# EAGLE design breakout_pmg001 (EAGLE 9.6.2)
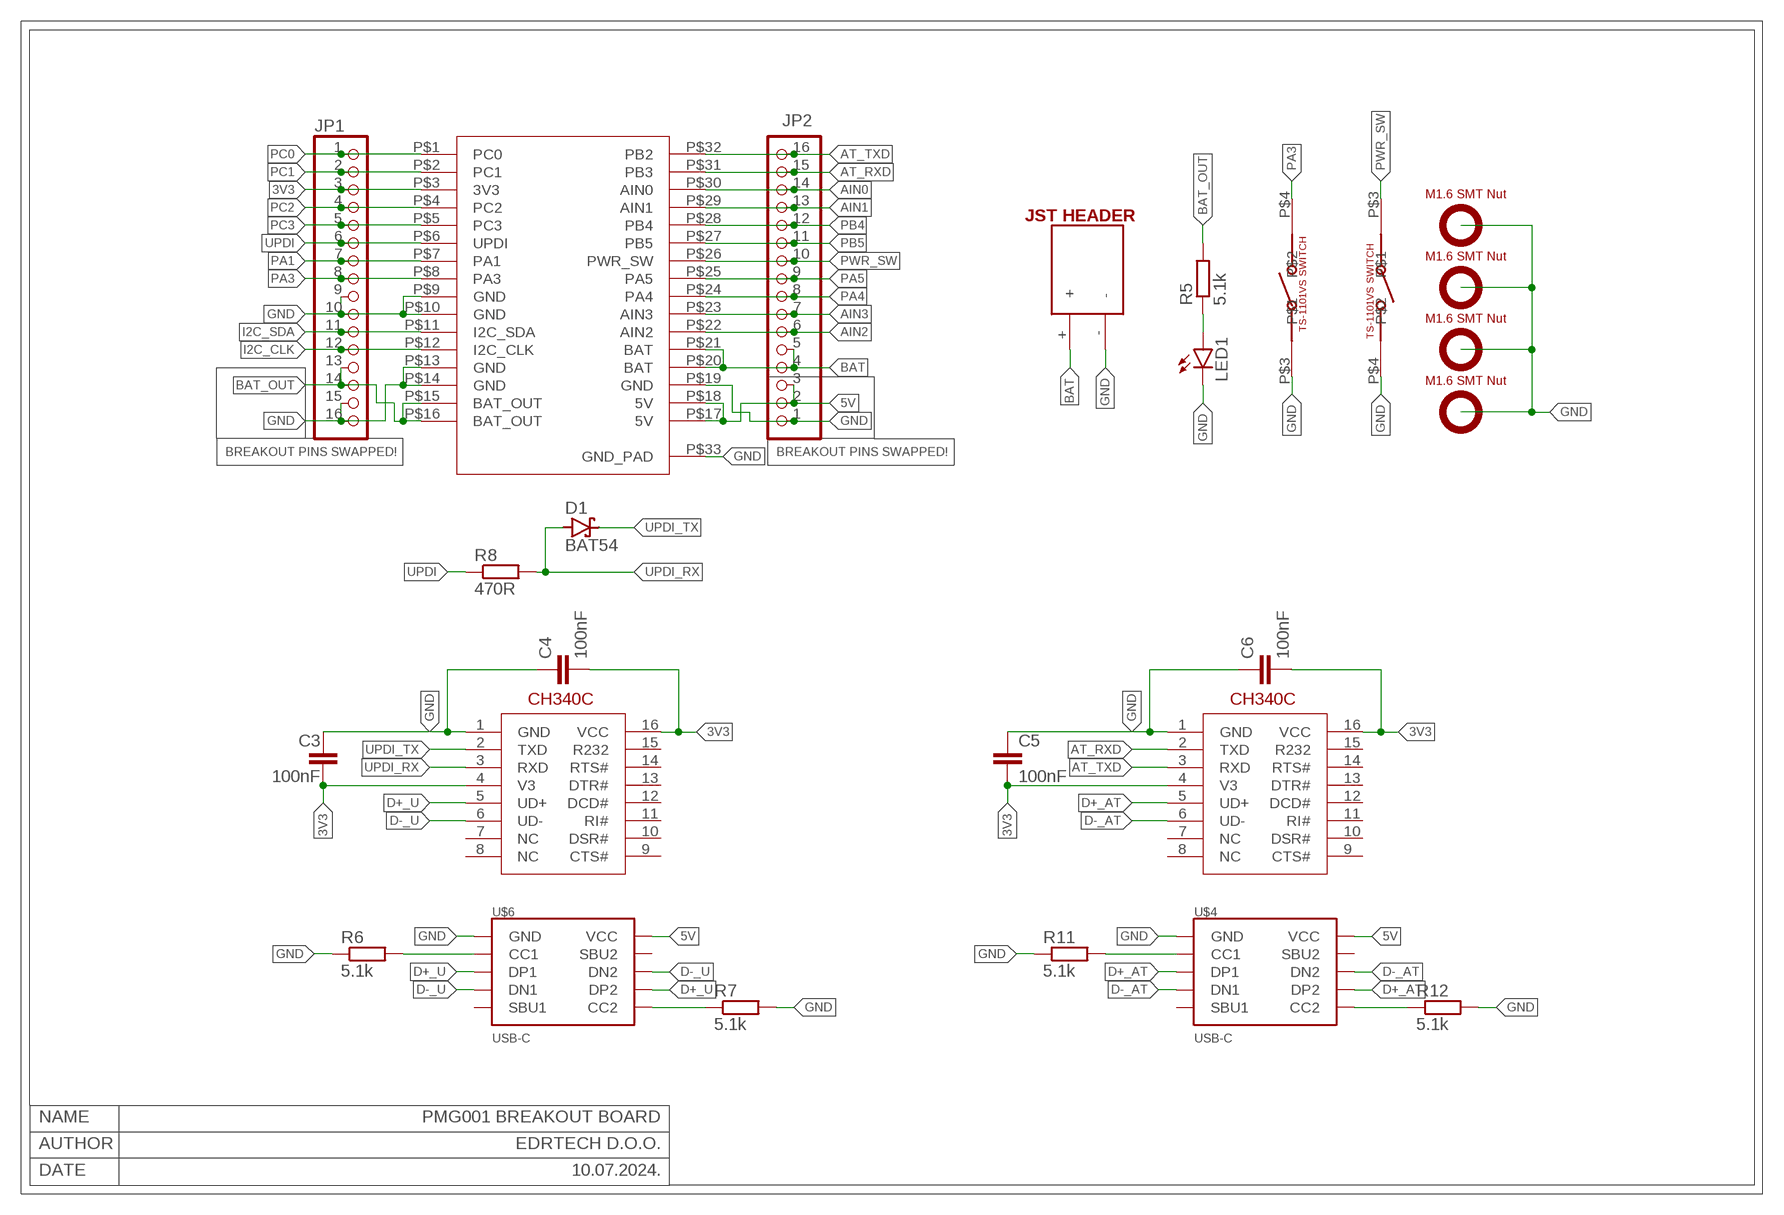
[diagram p0: schematic, sheet 1]

## Parts
C3  100nF  CC0603  [C0603]
C4  100nF  CC0603  [C0603]
C5  100nF  CC0603  [C0603]
C6  100nF  CC0603  [C0603]
D1  BAT54  [SOT23]
JP1  PINHD-1X16  [1X16]
JP2  PINHD-1X16  [1X16]
LED1  LEDCHIPLED_1206  [CHIPLED_1206]
R5  5.1k  R-EU_R0603  [R0603]
R6  5.1k  R-EU_R0603  [R0603]
R7  5.1k  R-EU_R0603  [R0603]
R8  470R  R-EU_R0603  [R0603]
R11  5.1k  R-EU_R0603  [R0603]
R12  5.1k  R-EU_R0603  [R0603]
SPEAKER_CON1  JST_HEADER_2MM_2P  [JST_HEADER]
U$1  CH340C  [CH340C]
U$2  TS-1101VS-C-A-A  [TS-1101VS-C-A-A]
U$3  TS-1101VS-C-A-A  [TS-1101VS-C-A-A]
U$4  USB-C  [USB-C]
U$5  CH340C  [CH340C]
U$6  USB-C  [USB-C]
U$7  PMG001  [PMG001]
U$8  SMTSO16  [SMTSO16]
U$9  SMTSO16  [SMTSO16]
U$10  SMTSO16  [SMTSO16]
U$11  SMTSO16  [SMTSO16]

## Nets
3V3: C3.2 C4.2 C5.2 C6.2 JP1.3 U$1.4(V3) U$1.16(VCC) U$5.4(V3) U$5.16(VCC) U$7.P$3(3V3)
5V: JP2.2 JP2.3 U$4.VCC@1(VCC) U$4.VCC@2(VCC) U$6.VCC@1(VCC) U$6.VCC@2(VCC) U$7.P$17(5V) U$7.P$18(5V)
AIN0: JP2.14 U$7.P$30(AIN0)
AIN1: JP2.13 U$7.P$29(AIN1)
AIN2: JP2.6 U$7.P$22(AIN2)
AIN3: JP2.7 U$7.P$23(AIN3)
AT_RXD: JP2.15 U$1.2(TXD) U$7.P$31(PB3)
AT_TXD: JP2.16 U$1.3(RXD) U$7.P$32(PB2)
BAT: JP2.4 JP2.5 SPEAKER_CON1.+ U$7.P$20(BAT) U$7.P$21(BAT)
BAT_OUT: JP1.13 JP1.14 R5.2 U$7.P$15(BAT_OUT) U$7.P$16(BAT_OUT)
D+_AT: U$1.5(UD+) U$4.DP1 U$4.DP2
D+_U: U$5.5(UD+) U$6.DP1 U$6.DP2
D-_AT: U$1.6(UD-) U$4.DN1 U$4.DN2
D-_U: U$5.6(UD-) U$6.DN1 U$6.DN2
GND: C3.1 C4.1 C5.1 C6.1 JP1.9 JP1.10 JP1.15 JP1.16 JP2.1 LED1.C R6.1 R7.2 R11.1 R12.2 SPEAKER_CON1.- U$1.1(GND) U$2.P$3 U$3.P$4 U$4.GND@1(GND) U$4.GND@2(GND) U$4.P$1(GND) U$4.P$2(GND) U$4.P$3(GND) U$4.P$4(GND) U$5.1(GND) U$6.GND@1(GND) U$6.GND@2(GND) U$6.P$1(GND) U$6.P$2(GND) U$6.P$3(GND) U$6.P$4(GND) U$7.P$9(GND) U$7.P$10(GND) U$7.P$13(GND) U$7.P$14(GND) U$7.P$19(GND) U$7.P$33(GND_PAD) U$8.P$1 U$9.P$1 U$10.P$1 U$11.P$1
I2C_CLK: JP1.12 U$7.P$12(I2C_CLK)
I2C_SDA: JP1.11 U$7.P$11(I2C_SDA)
N$3: LED1.A R5.1
N$4: R6.2 U$6.CC1
N$5: R7.1 U$6.CC2
N$8: R11.2 U$4.CC1
N$9: R12.1 U$4.CC2
PA1: JP1.7 U$7.P$7(PA1)
PA3: JP1.8 U$2.P$4 U$7.P$8(PA3)
PA4: JP2.8 U$7.P$24(PA4)
PA5: JP2.9 U$7.P$25(PA5)
PB4: JP2.12 U$7.P$28(PB4)
PB5: JP2.11 U$7.P$27(PB5)
PC0: JP1.1 U$7.P$1(PC0)
PC1: JP1.2 U$7.P$2(PC1)
PC2: JP1.4 U$7.P$4(PC2)
PC3: JP1.5 U$7.P$5(PC3)
PWR_SW: JP2.10 U$3.P$3 U$7.P$26(PWR_SW)
UPDI: JP1.6 R8.1 U$7.P$6(UPDI)
UPDI_RX: D1.1(A) R8.2 U$5.3(RXD)
UPDI_TX: D1.3(C) U$5.2(TXD)
Unconnected: U$1.7(NC) U$1.8(NC) U$1.9(CTS#) U$1.10(DSR#) U$1.11(RI#) U$1.12(DCD#) U$1.13(DTR#) U$1.14(RTS#) U$1.15(R232) U$4.SBU1 U$4.SBU2 U$5.7(NC) U$5.8(NC) U$5.9(CTS#) U$5.10(DSR#) U$5.11(RI#) U$5.12(DCD#) U$5.13(DTR#) U$5.14(RTS#) U$5.15(R232) U$6.SBU1 U$6.SBU2

## Notes on the sheet
- BREAKOUT PINS SWAPPED! | BREAKOUT PINS SWAPPED!
- NAME | PMG001 BREAKOUT BOARD
- AUTHOR | EDRTECH D.O.O.
- DATE | 10.07.2024.

## Library data of the parts
C3-C6 = eagle-ltspice:C: CAPACITOR, European symbol; SPICEMODEL: NONE; SPICEPREFIX: C
D1 = diode:BAT54: Schottky Diodes Source: Fairchild .. BAT54.pdf
JP1 JP2 = edrtech_lib:PINHD-1X16: PIN HEADER
LED1 = led:LED: LED OSRAM: - CHIPLED LG R971, LG N971, LY N971, LG Q971, LY Q971, LO R971, LY R971 LH N974, LH R974 LS Q976, LO Q976, LY Q976 LO Q996 - Hyper CHIPLED LW Q18S LB Q993, LB Q99A, LB R99A - SideLED LS A670, LO A670, LY A670, LG A670, LP A670 LB A673, LV A673, LT A673, LW A673 LH A674 LY A675 LS A676, LA A676, LO A676, LY A676, LW A676 LS A679, LY A679, LG A679 - Hyper Micro SIDELED® LS Y876, LA Y876, LO Y876, LY Y876 LT Y87S - SmartLED LW L88C, LW L88S LB L89C, LB L89S, LG L890 LS L89K, LO L89K, LY L89K LS L896, LA L896, LO L896, LY L896 - TOPLED LS T670, LO T670, LY T670, LG T670, LP T670 LSG T670, LSP T670, LSY T670, LOP T670, LYG T670 LG T671, LOG T671, LSG T671 LB T673, LV T673, LT T673, LW T673 LH T674 LS T676, LA T676, LO T676, LY T676, LB T676, LH T676, LSB T676, LW T676 LB T67C, LV T67C, LT T67C, LS T67K, LO T67K, LY T67K, LW E67C LS E67B, LA E67B, LO E67B, LY E67B, LB E67C, LV E67C, LT E67C LW T67C LS T679, LY T679, LG T679 LS T770, LO T770, LY T770, LG T770, LP T770 LB T773, LV T773, LT T773, LW T773 LH T774 LS E675, LA E675, LY E675, LS T675 LS T776, LA T776, LO T776, LY T776, LB T776 LHGB T686 LT T68C, LB T68C - Hyper Mini TOPLED® LB M676 - Mini TOPLED Santana® LG M470 LS M47K, LO M47K, LY M47K Source: http://www.osram.convergy.de LUXEON: - LUMILED® LXK2-PW12-R00, LXK2-PW12-S00, LXK2-PW14-U00, LXK2-PW14-V00 LXK2-PM12-R00, LXK2-PM12-S00, LXK2-PM14-U00 LXK2-PE12-Q00, LXK2-PE12-R00, LXK2-PE12-S00, LXK2-PE14-T00, LXK2-PE14-U00 LXK2-PB12-K00, LXK2-PB12-L00, LXK2-PB12-M00, LXK2-PB14-N00, LXK2-PB14-P00, LXK2-PB14-Q00 LXK2-PR12-L00, LXK2-PR12-M00, LXK2-PR14-Q00, LXK2-PR14-R00 LXK2-PD12-Q00, LXK2-PD12-R00, LXK2-PD12-S00 LXK2-PH12-R00, LXK2-PH12-S00 LXK2-PL12-P00, LXK2-PL12-Q00, LXK2-PL12-R00 Source: www.luxeon.com KINGBRIGHT: KA-3528ASYC Source: www.kingbright.com
R5-R8 R11 R12 = rcl:R-EU_: RESISTOR, European symbol; SPICEPREFIX: R
SPEAKER_CON1 = edrtech_lib:JST_HEADER_2MM_2P
U$1 U$5 = circuitmess_device_library:CH340C
U$2 U$3 = circuitmess_device_library:TS-1101VS-C-A-A
U$4 U$6 = edrtech_lib:USB-C
U$7 = edrtech_lib:PMG001
U$8-U$11 = edrtech_lib:SMTSO16

## Board
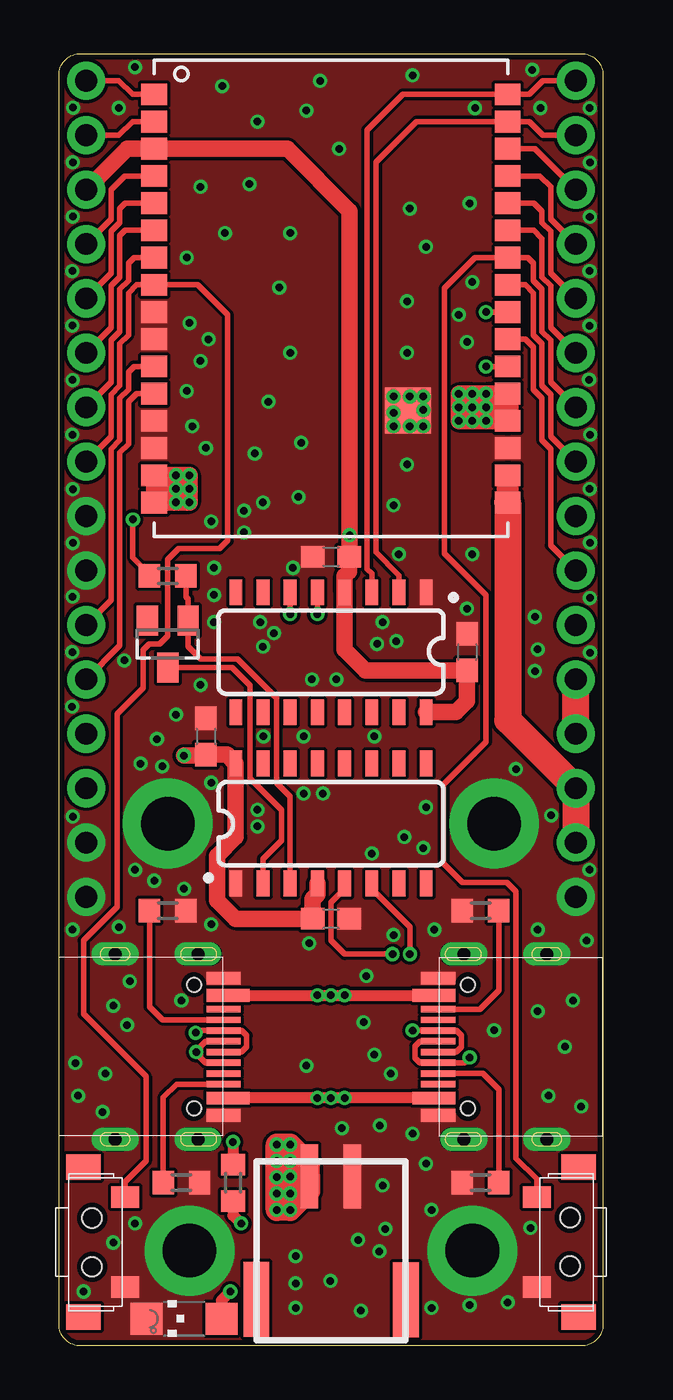
[diagram p1: board, top side]
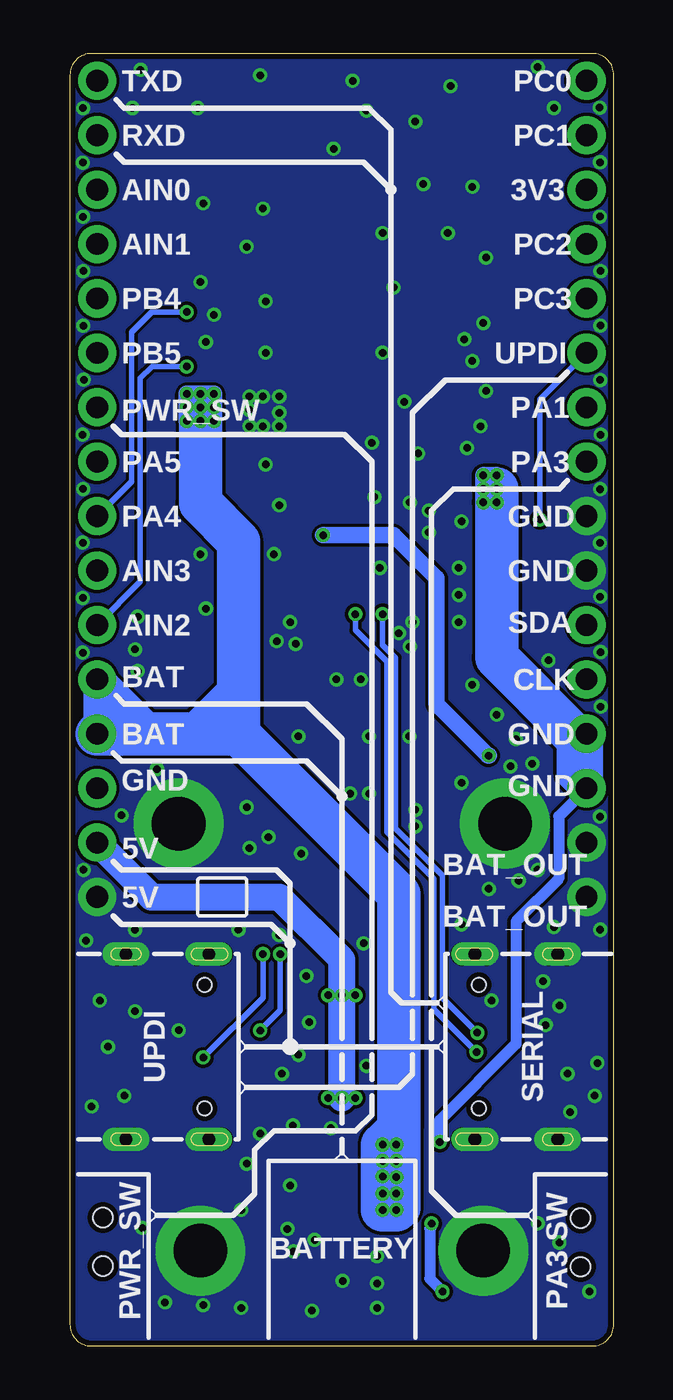
[diagram p2: board, bottom side, seen from below]

Size 25.4 x 60.33 mm. Coordinates in mm from the lower left corner, seen from the top.
Outline: 0,1 0,59.33 arc-90 1,60.33 24.4,60.33 arc-90 25.4,59.33 25.4,1 arc-90 24.4,0 1,0 arc-90 0,1
Copper layers (1*16): Top 0.035mm / dielectric 1.5mm / Bottom 0.035mm
Design rules "dirt_cheap_dirty_boards.v1.1 *": minimum track width 6mil, minimum drill 12mil, track to track 6mil, track to pad 6mil, pad to pad 6mil, via to via 6mil, smd to smd 0mil, copper to edge 10mil, drill to drill 10mil, minimum pad ring 10mil, minimum via ring 6mil, stop-mask expansion 2mil, vias tented up to drill 25mil, thermal gap 10mil

### Footprints (pad centres in the part's own frame; a part is rotated, then mirrored left to right if it is on the bottom)
C0603 = smd 1.1 x 1: 1 -0.85,0; 2 0.85,0
SOT23 = smd 1 x 1.4: 1 -0.95,-1.1; 2 0.95,-1.1; 3 0,1.1
1X16 = drill 1.016 pad 1.778: 1 -19.05,0; 2 -16.51,0; 3 -13.97,0; 4 -11.43,0; 5 -8.89,0; 6 -6.35,0; 7 -3.81,0; 8 -1.27,0; 9 1.27,0; 10 3.81,0; 11 6.35,0; 12 8.89,0; 13 11.43,0; 14 13.97,0; 15 16.51,0; 16 19.05,0
CHIPLED_1206 = smd 1.5 x 1.5: A 0,-1.75; C 0,1.75
R0603 = smd 1 x 1.1: 1 -0.85,0; 2 0.85,0
JST_HEADER = smd 0.8 x 3: + 1.015,-3.47; - -0.995,-3.47 | smd 1.2 x 3.5: @GND -3.505,2.28; @GND1 3.485,2.27
CH340C = smd 0.6 x 1.2: 1 -4.445,-2.8; 2 -3.175,-2.8; 3 -1.905,-2.8; 4 -0.635,-2.8; 5 0.635,-2.8; 6 1.905,-2.8; 7 3.175,-2.8; 8 4.445,-2.8; 9 4.445,2.8; 10 3.175,2.8; 11 1.905,2.8; 12 0.635,2.8; 13 -0.635,2.8; 14 -1.905,2.8; 15 -3.175,2.8; 16 -4.445,2.8
TS-1101VS-C-A-A = smd 1.2 x 1.6: GND -3.5,0; GND@1 3.5,0 | smd 1 x 1.3: P$3 -2.1,-1.95; P$4 2.1,-1.95 | hole 0.9: -1.15,-0.4; 1.12,-0.4
USB-C = smd 0.3 x 1.6: CC1 -1.25,3.88; CC2 1.75,3.88; DN1 0.25,3.88; DN2 -0.75,3.88; DP1 -0.25,3.88; DP2 0.75,3.88; SBU1 1.25,3.88; SBU2 -1.75,3.88 | smd 0.6 x 1.6: GND@1 -3.2,3.88; GND@2 3.2,3.88 | drill 0.6 pad 1 long: P$1 -4.32,-1.19; P$2 4.32,-1.19; P$3 4.32,2.68; P$4 -4.32,2.68 | smd 0.6 x 2: VCC@1 -2.4,4.08; VCC@2 2.4,4.08 | hole 0.65: 2.89,2.49; -2.89,2.49
PMG001 = smd 1.194 x 1.016: P$1 -8.255,9.525; P$2 -8.255,8.255; P$3 -8.255,6.985; P$4 -8.255,5.715; P$5 -8.255,4.445; P$6 -8.255,3.175; P$7 -8.255,1.905; P$8 -8.255,0.635; P$9 -8.255,-0.635; P$10 -8.255,-1.905; P$11 -8.255,-3.175; P$12 -8.255,-4.445; P$13 -8.255,-5.715; P$14 -8.255,-6.985; P$15 -8.255,-8.255; P$16 -8.255,-9.525; P$17 8.255,-9.525; P$18 8.255,-8.255; P$19 8.255,-6.985; P$20 8.255,-5.715; P$21 8.255,-4.445; P$22 8.255,-3.175; P$23 8.255,-1.905; P$24 8.255,-0.635; P$25 8.255,0.635; P$26 8.255,1.905; P$27 8.255,3.175; P$28 8.255,4.445; P$29 8.255,5.715; P$30 8.255,6.985; P$31 8.255,8.255; P$32 8.255,9.525 | smd 2.15 x 2.15: P$33 3.6,-5.24
SMTSO16 = drill 2.5 pad 4.19: P$1 0,0

### Placement (x,y rotation side)
C3  12.7,19.94 180 top
C4  12.7,36.83 0 top
C5  6.86,28.45 270 top
C6  19.05,32.38 270 top
D1  5.08,32.77 180 top
JP1  1.27,40.01 270 top
JP2  24.13,40.01 90 top
LED1  5.84,1.27 90 top
R5  8.13,7.62 90 top
R6  19.68,7.62 0 top
R7  19.68,20.32 180 top
R8  5.08,35.94 0 top
R11  5.08,20.32 180 top
R12  5.71,7.62 0 top
SPEAKER_CON1  12.7,4.45 180 top
U$1  12.7,32.38 180 top
U$2  1.14,4.84 90 top
U$3  24.26,4.84 270 top
U$4  3.81,13.97 270 top
U$5  12.7,24.38 0 top
U$6  21.59,13.97 90 top
U$7  12.7,48.9 0 top
U$8  19.3,4.45 0 top
U$9  6.1,4.45 0 top
U$10  5.08,24.38 0 top
U$11  20.32,24.38 0 top

### Tracks (layer width: path | path; a pad name or v marks a point on that pad's centre or on a via)
3V3  (via drill 0.35)
  Top 0.762: JP1.3 3.17,55.88 U$7.P$3 10.67,55.88 13.57,52.98 v13.57,37.85 | v13.57,37.85 | v13.57,37.85 13.57,36.85 C4.2 13.55,36.16 13.34,35.94 U$1.4 13.34,32.51 14.31,31.54 C6.2 19.05,30.1 18.54,29.59 U$1.16 | U$5.4 12.06,21.08 11.85,20.87 C3.2 8.25,19.94 7.38,20.8 7.38,22.88 8.26,23.75 U$5.16 7.84,27.6 C5.2 6.82,27.56 v5.84,27.56
  Bottom 0.762: v13.57,37.85 10.29,37.85 8.28,35.84 8.28,29.96 5.87,27.56 v5.84,27.56
5V  (via drill 0.35)
  Top 0.508: U$4.VCC@1 v12.06,16.37 v12.7,16.37 v13.34,16.37 U$6.VCC@2 | U$6.VCC@1 v13.34,11.57 v12.7,11.57 v12.06,11.57 U$4.VCC@2
  Top 1.016: U$7.P$17 U$7.P$18
  Top 1.27: U$7.P$17 20.95,29.21 JP2.3 JP2.2
  Bottom 0.508: v12.06,16.37 v12.7,16.37 v13.34,16.37 | v12.06,11.57 v12.7,11.57 v13.34,11.57
  Bottom 1.27: v12.7,11.57 v12.7,16.37 12.7,18.03 15.62,20.95 21.59,20.95 JP2.2
AIN0
  Top 0.254: U$7.P$30 22.23,55.88 JP2.14
AIN1
  Top 0.254: U$7.P$29 22.45,54.61 22.96,54.1 22.96,52.6 JP2.13
AIN2  (via drill 0.35)
  Top 0.254: U$7.P$22 v19.94,45.72
  Bottom 0.254: v19.94,45.72 21.57,45.72 22.11,45.17 22.11,35.67 JP2.6
AIN3
  Top 0.254: U$7.P$23 21.77,46.99 22.15,46.61 22.15,44.65 22.55,44.24 22.55,42.27 22.96,41.87 22.96,37.36 JP2.7
AT_RXD
  Top 0.254: JP2.15 22.61,56.52 21.97,57.15 U$7.P$31 16.7,57.15 14.79,55.25 14.79,37.05 15.88,35.97 U$1.2
AT_TXD
  Top 0.254: JP2.16 22.61,59.05 21.97,58.42 U$7.P$32 16.05,58.42 14.38,56.75 14.38,36.27 14.61,36.05 U$1.3
BAT  (via drill 0.35)
  Top 0.762: 20.32,44.45 v19.94,44.45 v18.67,44.45 | v19.94,43.81 v19.94,43.18 | v19.3,43.18 v19.3,43.81 | v19.3,44.45 v18.67,44.45 | v18.67,43.81 v18.67,43.18 | 20.32,44.45 U$7.P$21 | v18.67,44.45 18.67,44.07 | 18.67,44.07 v18.67,43.18 | v18.67,43.18 U$7.P$20 20.32,43.81 | 20.32,43.81 20.32,44.45 | 18.67,44.07 20.07,44.07 20.32,43.81
  Top 1.016: U$7.P$20 U$7.P$21 | SPEAKER_CON1.+ v10.79,7.92 | v10.79,8.64 v10.79,9.4 | v10.16,9.4 v10.16,8.64 | v10.16,7.87 v10.16,7.11 | v10.79,7.11 v10.79,6.35 | v10.16,9.4 v10.16,6.35 v10.79,6.35 | v10.79,9.4 v10.16,9.4 | SPEAKER_CON1.+ 11.69,8.51 v10.79,9.4 | SPEAKER_CON1.+ 11.69,7.24 v10.79,6.35
  Top 1.27: JP2.4 JP2.5
  Bottom 0.762: v19.94,44.45 v19.94,43.81 | v19.94,43.18 v19.3,43.18 | v19.3,43.81 v19.3,44.45 | v18.67,44.45 v18.67,43.81 | v19.94,43.18 v18.67,43.18 v18.67,44.45 | v19.94,43.18 v19.94,44.45 | v19.94,44.45 v18.67,44.45
  Bottom 1.016: v10.79,7.92 v10.79,8.64 | v10.79,9.4 v10.16,9.4 | v10.16,8.64 v10.16,7.87 | v10.16,7.11 v10.79,7.11
  Bottom 1.27: JP2.4 JP2.5
  Bottom 1.524: JP2.5 21.84,28.83 22.1,28.57 JP2.4
  Bottom 2.032: JP2.4 19.43,28.57 | 19.43,28.57 17.53,28.57 | 17.53,28.57 10.03,21.08 10.03,10.16 | 10.03,10.16 v10.79,9.4 v10.79,6.35 v10.16,6.35 | v10.16,9.4 v10.16,6.35 | v10.16,8.64 10.03,8.76 | 10.03,8.76 10.03,10.16 | v10.16,6.35 10.03,6.48 10.03,8.76 | v19.3,43.81 19.3,39.33 17.53,37.55 17.53,30.48 | 17.53,30.48 17.53,28.57 | 19.43,28.57 17.53,30.48
BAT_OUT  (via drill 0.35)
  Top 0.508: v8.13,9.53 R5.2
  Top 0.762: U$7.P$15 U$7.P$16 5.08,39.37 | 5.08,39.37 v5.46,39.37 | v5.46,40.01 v6.1,40.01 | U$7.P$15 v5.46,40.64 | v5.46,40.64 v6.1,40.64 v6.1,39.37 v5.46,39.37 | v5.46,39.37 v5.46,40.64 | U$7.P$15 5.08,40.01 5.08,39.37
  Bottom 0.508: JP1.14 2.58,24.73 2.58,21.8 4.57,19.81 4.57,14.1 8.13,10.54 v8.13,9.53
  Bottom 0.762: v5.46,39.37 v5.46,40.01 | v6.1,40.01 v6.1,40.64 | v5.46,39.37 v6.1,39.37 v6.1,40.64 | v5.46,39.37 v5.46,40.64 v6.1,40.64
  Bottom 1.524: JP1.13 JP1.14 1.91,26.67 1.91,28.57
  Bottom 2.032: v5.46,40.01 5.46,32.13 1.91,28.57
D+_AT  (via drill 0.35)
  Top 0.254: U$4.DP1 6.84,14.22 6.61,13.99 | U$4.DP2 6.84,13.22 6.61,13.45 | 6.61,13.45 6.61,13.99 | 6.61,13.45 6.41,13.65 v6.41,13.72 6.41,13.79 6.61,13.99 | U$1.5 v12.06,34.16
  Bottom 0.254: v12.06,34.16 12.06,33.41 10.6,31.94 10.6,23.99 8.41,21.8 8.41,15.71 v6.41,13.72
D+_U  (via drill 0.35)
  Top 0.254: U$6.DP1 18.55,13.72 18.79,13.95 18.79,14.49 18.55,14.72 U$6.DP2 v16.51,14.72 | v15.58,18.29 13.34,18.29 12.7,18.92 12.7,20.7 13.34,21.34 U$5.5
  Bottom 0.254: v16.51,14.72 15.58,15.65 v15.58,18.29
D-_AT  (via drill 0.35)
  Top 0.254: U$4.DN1 8.54,13.72 8.77,13.95 8.77,14.49 8.54,14.72 U$4.DN2 6.49,14.72 v6.38,14.61 | v10.79,34.16 U$1.6
  Bottom 0.254: v6.38,14.61 8,16.23 8,21.96 10.2,24.16 10.2,32.11 10.79,32.71 v10.79,34.16
D-_U  (via drill 0.35)
  Top 0.254: U$6.DN1 16.86,14.22 16.63,13.99 16.63,13.45 16.86,13.22 U$6.DN2 18.93,13.22 v19.18,13.46 | U$5.6 14.61,21.34 16.38,19.56 v16.38,18.29
  Bottom 0.254: v19.18,13.46 16.38,16.26 v16.38,18.29
GND  (via drill 0.35)
  other vias: 15.62,44.32 16.38,44.32 15.62,43.56 15.62,42.93 17.02,44.32 17.02,43.69 17.02,42.93 16.38,42.93 3.56,59.69 7.62,58.8 12.19,59.05 16.51,59.31 22.1,59.56 22.48,57.78 19.43,57.78 13.08,55.88 9.27,57.15 6.6,54.1 2.79,57.78 16.38,53.09 19.18,53.34 16.26,48.77 16.26,46.35 17.14,51.31 10.79,51.94 8.89,54.23 7.75,51.94 10.29,49.4 6.1,47.75 6.6,45.97 5.97,44.58 6.22,42.93 6.86,41.91 9.78,44.07 10.79,46.35 6.99,46.99 5.97,50.8 11.3,42.16 16.26,41.15 15.62,39.24 11.18,39.62 9.14,41.66 10.92,36.32 15.88,36.96 19.3,36.96 22.23,31.5 22.35,32.51 22.23,34.04 8.64,38.99 9.53,39.37 11.81,31.11 15.11,33.78 14.86,32.77 15.75,32.89 3.05,32 11.43,28.45 14.73,28.45 11.43,25.78 7.11,19.68 5.84,21.34 2.79,19.56 16.13,23.75 17.53,19.43 14.61,22.99 15.62,19.18 11.68,18.8 14.35,17.27 14.22,15.11 14.73,13.59 15.49,12.7 14.99,10.29 16.51,9.91 20.32,14.73 24.64,18.92 22.35,19.43 24,16.13 22.35,15.62 23.62,13.97 24.38,11.18 22.86,11.68 11.56,13.08 11.05,4.19 2.54,15.88 5.71,16.13 0.64,19.43 0.89,11.68 2.03,10.92 0.76,13.21 2.16,12.7 3.17,14.99 15.11,7.49 15.24,5.46 17.4,6.35 13.97,4.95 13.21,10.16 17.14,8.51 14.96,4.41 1.14,2.54 2.54,4.83 11.05,2.92 3.56,5.71 11.05,1.78 14.1,1.65 17.4,1.78 19.18,1.91 22.02,5.51 12.67,3.04 20.95,2.03 19.3,49.66 18.67,48.13 19.05,46.86 24.75,45.1 24.8,42.53 24.78,40 24.8,37.5 24.79,34.92 24.8,32.36 24.78,47.62 24.78,50.17 24.79,52.71 24.79,55.24 24.78,57.78 0.66,57.8 0.64,55.25 0.65,52.71 0.62,50.17 0.62,47.63 0.63,45.09 0.62,42.54 0.64,39.99 0.65,37.48 0.64,34.98 0.62,32.38 0.65,24.71 0.61,29.84 9.27,24.26 9.27,25.02 4.45,21.72 3.81,27.18 4.57,28.32 4.83,27.05 5.46,29.46 6.6,30.86 7.11,26.29 12.32,25.78 17.14,25.15 17.02,23.24 21.34,26.92 22.99,24.77 24.77,22.23 3.3,17.02 3.56,22.23 7.24,33.78 7.24,35.05 7.24,36.32 7.11,38.48 8.64,37.97 19.05,34.42 12.95,31.11 9.4,33.78 9.53,32.64 10.03,33.27 11.56,57.66 9.55,28.45
  pour Top (no thermals): 0,0 25.4,0 25.4,60.33 0,60.33
  pour Bottom (no thermals): 0,0 25.4,0 25.4,60.33 0,60.33
I2C_CLK
  Top 0.254: U$7.P$12 3.63,44.45 3.25,44.07 3.25,42.11 2.85,41.7 2.85,32.69 JP1.12
I2C_SDA
  Top 0.254: U$7.P$11 3.5,45.72 3.25,45.47 3.25,44.65 2.85,44.24 2.85,42.27 2.44,41.87 2.44,34.82 JP1.11
N$3  (via drill 0.35)
  Top 0.508: R5.1 8.13,6.1 v8.51,5.71 | v8,2.54 7.59,2.13 LED1.A
  Bottom 0.508: v8.51,5.71 8.51,5.57 8.6,5.48 8.6,3.14 v8,2.54
N$4
  Top 0.254: U$6.CC1 19.79,12.72 20.54,11.98 R6.2
N$5
  Top 0.254: U$6.CC2 19.66,15.72 20.54,16.6 R7.1
N$8
  Top 0.254: U$4.CC1 4.85,15.22 4.23,15.84 R11.2
N$9
  Top 0.254: U$4.CC2 5.49,12.22 4.87,11.6 R12.1
PA1
  Top 0.254: U$7.P$7 3.5,50.8 3.25,50.55 3.25,49.73 2.85,49.32 2.85,47.35 2.44,46.95 2.44,44.98 JP1.7
PA3
  Top 0.254: JP1.8 2.44,42.44 2.44,44.41 2.85,44.81 2.85,46.78 3.25,47.19 3.25,49.15 3.63,49.53 U$7.P$8 6.48,49.53 7.87,48.13 7.87,37.59 7.49,37.21 5.59,37.21 5.08,36.7 5.08,33.15 4.71,32.77 4.21,32.77 3.92,32.48 3.92,30.72 2.71,29.5 2.71,20.49 1.14,18.92 1.14,15.49 4.06,12.57 4.06,8.64 3.09,7.67 U$2.P$4
PA4  (via drill 0.35)
  Top 0.254: U$7.P$24 v19.94,48.26
  Bottom 0.254: v19.94,48.26 21.59,48.26 22.52,47.33 22.52,40.35 JP2.8
PA5
  Top 0.254: U$7.P$25 21.77,49.53 22.15,49.15 22.15,47.19 22.55,46.78 22.55,44.81 22.96,44.41 22.96,42.44 JP2.9
PB4
  Top 0.254: U$7.P$28 22.17,53.34 22.55,52.96 22.55,52.44 22.96,52.03 22.96,50.06 JP2.12
PB5
  Top 0.254: U$7.P$27 22.17,52.07 22.55,51.69 22.55,49.9 22.96,49.49 22.96,47.52 JP2.11
PC0
  Top 0.254: U$7.P$1 3.43,58.42 2.79,59.05 JP1.1
PC1
  Top 0.254: U$7.P$2 3.43,57.15 2.79,56.52 JP1.2
PC2
  Top 0.254: U$7.P$4 3.07,54.61 2.44,53.98 2.44,52.6 JP1.4
PC3
  Top 0.254: U$7.P$5 3.1,53.34 2.85,53.09 2.85,52.44 2.44,52.03 2.44,50.06 JP1.5
PWR_SW
  Top 0.254: JP2.10 22.96,44.98 22.96,46.95 22.55,47.35 22.55,49.32 22.15,49.73 22.15,50.55 21.89,50.8 U$7.P$26 19.43,50.8 18,49.37 18,36.99 19.94,35.05 19.94,28.19 17.95,26.2 17.95,22.51 18.83,21.63 20.92,21.63 21.34,21.21 21.34,8.76 22.31,7.79 U$3.P$3
UPDI  (via drill 0.35)
  Top 0.254: U$7.P$6 3.1,52.07 2.85,51.82 2.85,49.9 2.44,49.49 2.44,47.52 JP1.6 | v3.45,38.58 3.45,36.81 4.23,36.03 R8.1
  Bottom 0.254: JP1.6 3.45,44.17 v3.45,38.58
UPDI_RX
  Top 0.254: R8.2 5.93,34.96 6.03,34.86 D1.1 6.03,32.65 6.6,32.07 8.33,32.07 10.16,30.25 10.16,26.29 10.79,25.65 U$5.3
UPDI_TX
  Top 0.254: D1.3 8.09,31.67 8.93,30.82 8.93,26.48 10.39,25.02 10.39,23.6 9.53,22.73 U$5.2

### Text on the board
bPlace: PC0 | TXD | PC1 | RXD | 3V3 | AIN0 | PC2 | AIN1 | PC3 | PB4 | UPDI | PB5 | PA1 | PWR_SW | PA3 | PA5 | GND | PA4 | GND | AIN3 | SDA | AIN2 | CLK | BAT | GND | BAT | GND | GND | 5V | BAT_OUT | 5V | BAT_OUT | SERIAL | UPDI | BATTERY | PA3 SW | PWR_SW
bStop: PMG001 / Breakout / board | EDrTech